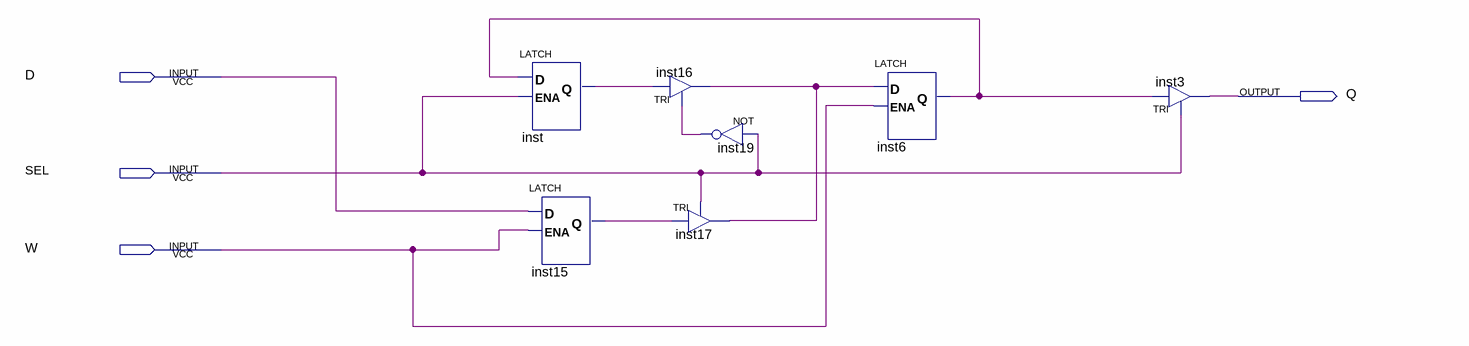
[diagram p0: schematic sheet]
// Quartus schematic ram.bdf as structural Verilog: 7 symbols, 4 pins
module ram (
  input  D,
  input  SEL,
  input  W,
  output Q
);

  wire inst6_q, inst15_q, inst16_out, inst19_out, inst_q;

  LATCH inst (.D(inst6_q), .ENA(SEL), .Q(inst_q));
  LATCH inst15 (.D(D), .ENA(W), .Q(inst15_q));
  TRI inst16 (.IN(inst_q), .OE(inst19_out), .OUT(inst16_out));
  not inst19 (inst19_out, SEL);
  TRI inst17 (.IN(inst15_q), .OE(SEL), .OUT(inst16_out));
  LATCH inst6 (.D(inst16_out), .ENA(W), .Q(inst6_q));
  TRI inst3 (.IN(inst6_q), .OE(SEL), .OUT(Q));
endmodule
